# EAGLE design feuchtigkeitssensor-wasserpumpe-arduino-micro (EAGLE 7.3.0)
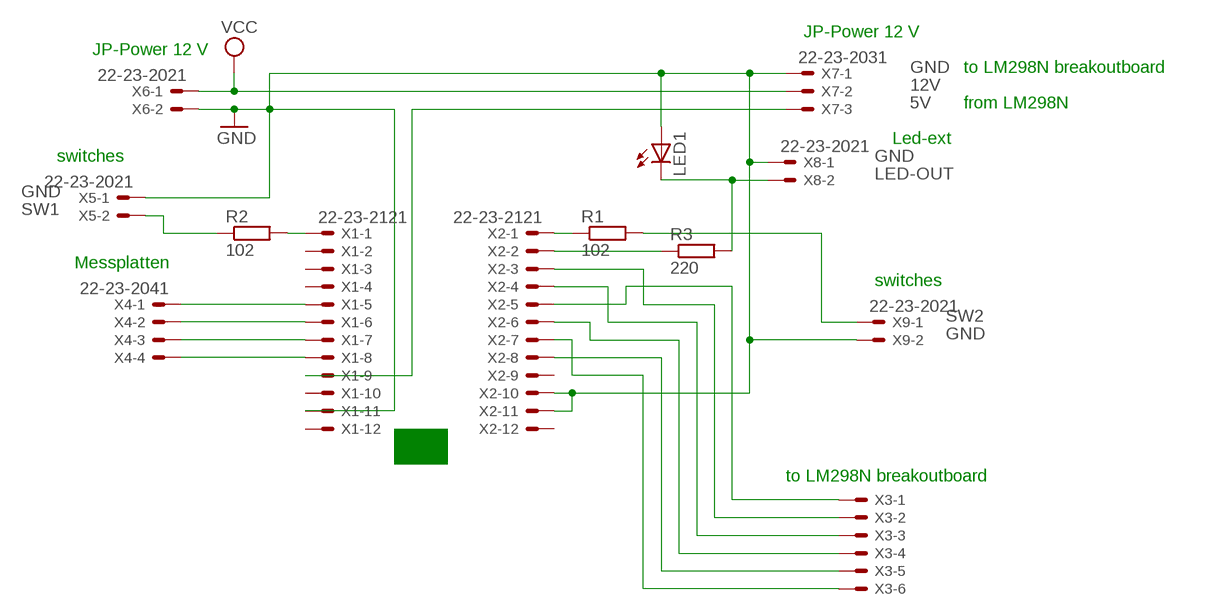
[diagram p0: schematic, sheet 1]

## Parts
LED1  LED5MM  [LED5MM]
R1  102  R-EU_M1206  [M1206]
R2  102  R-EU_M1206  [M1206]
R3  220  R-EU_M1206  [M1206]
X1  22-23-2121  [22-23-2121]
X2  22-23-2121  [22-23-2121]
X3  22-23-2061  [22-23-2061]
X4  22-23-2041  [22-23-2041]
X5  22-23-2021  [22-23-2021]
X6  22-23-2021  [22-23-2021]
X7  22-23-2031  [22-23-2031]
X8  22-23-2021  [22-23-2021]
X9  22-23-2021  [22-23-2021]

## Nets
5V [5v]: X1.9 X7.3
12V [gnd]: X6.1 X7.2 ; supply symbol labelled VCC
GND [gnd]: LED1.A X1.11 X2.10 X2.11 X5.1 X6.2 X7.1 X8.1 X9.2
LED-OUT: LED1.K(C) R3.2 X8.2
N$1: X1.8 X4.4
N$2: X1.7 X4.3
N$3: X1.6 X4.2
N$4: X1.5 X4.1
N$5: R2.2 X1.1
N$6: R1.1 X2.1
N$7: R3.1 X2.2
N$9: X2.5 X3.1
N$10: X2.3 X3.2
N$11: X2.4 X3.3
N$12: X2.7 X3.6
N$13: X2.8 X3.5
N$14: X2.6 X3.4
SW1: R2.1 X5.2
SW2: R1.2 X9.1
Unconnected: X1.2 X1.3 X1.4 X1.10 X1.12 X2.9 X2.12

## Notes on the sheet
- JP-Power 12 V
- JP-Power 12 V
- to LM298N breakoutboard
- from LM298N
- Led-ext
- switches
- Messplatten
- switches
- to LM298N breakoutboard

## Library data of the parts
LED1 = led:LED: LED OSRAM: - CHIPLED LG R971, LG N971, LY N971, LG Q971, LY Q971, LO R971, LY R971 LH N974, LH R974 LS Q976, LO Q976, LY Q976 LO Q996 - Hyper CHIPLED LW Q18S LB Q993, LB Q99A, LB R99A - SideLED LS A670, LO A670, LY A670, LG A670, LP A670 LB A673, LV A673, LT A673, LW A673 LH A674 LY A675 LS A676, LA A676, LO A676, LY A676, LW A676 LS A679, LY A679, LG A679 - Hyper Micro SIDELED® LS Y876, LA Y876, LO Y876, LY Y876 LT Y87S - SmartLED LW L88C, LW L88S LB L89C, LB L89S, LG L890 LS L89K, LO L89K, LY L89K LS L896, LA L896, LO L896, LY L896 - TOPLED LS T670, LO T670, LY T670, LG T670, LP T670 LSG T670, LSP T670, LSY T670, LOP T670, LYG T670 LG T671, LOG T671, LSG T671 LB T673, LV T673, LT T673, LW T673 LH T674 LS T676, LA T676, LO T676, LY T676, LB T676, LH T676, LSB T676, LW T676 LB T67C, LV T67C, LT T67C, LS T67K, LO T67K, LY T67K, LW E67C LS E67B, LA E67B, LO E67B, LY E67B, LB E67C, LV E67C, LT E67C LW T67C LS T679, LY T679, LG T679 LS T770, LO T770, LY T770, LG T770, LP T770 LB T773, LV T773, LT T773, LW T773 LH T774 LS E675, LA E675, LY E675, LS T675 LS T776, LA T776, LO T776, LY T776, LB T776 LHGB T686 LT T68C, LB T68C - Hyper Mini TOPLED® LB M676 - Mini TOPLED Santana® LG M470 LS M47K, LO M47K, LY M47K Source: http://www.osram.convergy.de LUXEON: - LUMILED® LXK2-PW12-R00, LXK2-PW12-S00, LXK2-PW14-U00, LXK2-PW14-V00 LXK2-PM12-R00, LXK2-PM12-S00, LXK2-PM14-U00 LXK2-PE12-Q00, LXK2-PE12-R00, LXK2-PE12-S00, LXK2-PE14-T00, LXK2-PE14-U00 LXK2-PB12-K00, LXK2-PB12-L00, LXK2-PB12-M00, LXK2-PB14-N00, LXK2-PB14-P00, LXK2-PB14-Q00 LXK2-PR12-L00, LXK2-PR12-M00, LXK2-PR14-Q00, LXK2-PR14-R00 LXK2-PD12-Q00, LXK2-PD12-R00, LXK2-PD12-S00 LXK2-PH12-R00, LXK2-PH12-S00 LXK2-PL12-P00, LXK2-PL12-Q00, LXK2-PL12-R00 Source: www.luxeon.com KINGBRIGHT: KA-3528ASYC Source: www.kingbright.com
R1-R3 = resistor:R-EU_: RESISTOR, European symbol
X1 X2 = con-molex:22-23-2121: .100" (2.54mm) Center Header - 12 Pin; MF: MOLEX; MPN: 22-23-2121; OC_FARNELL: 1462935; OC_NEWARK: 56H0456
X3 = con-molex:22-23-2061: .100" (2.54mm) Center Header - 6 Pin; MF: MOLEX; MPN: 22-23-2061; OC_FARNELL: 1462922; OC_NEWARK: 27C1933
X4 = con-molex:22-23-2041: .100" (2.54mm) Center Header - 4 Pin; MF: MOLEX; MPN: 22-23-2041; OC_FARNELL: 1462920; OC_NEWARK: 38C0355
X5 X6 X8 X9 = con-molex:22-23-2021: .100" (2.54mm) Center Header - 2 Pin; MF: MOLEX; MPN: 22-23-2021; OC_FARNELL: 1462926; OC_NEWARK: 25C3832
X7 = con-molex:22-23-2031: .100" (2.54mm) Center Header - 3 Pin; MF: MOLEX; MPN: 22-23-2031; OC_FARNELL: 1462950; OC_NEWARK: 30C0862

## Net classes
1 gnd: width 1.016 mm, drill 0.508 mm, clearance 0.508 mm
2 5v: width 0.762 mm, drill 0.508 mm, clearance 0.508 mm

## Board
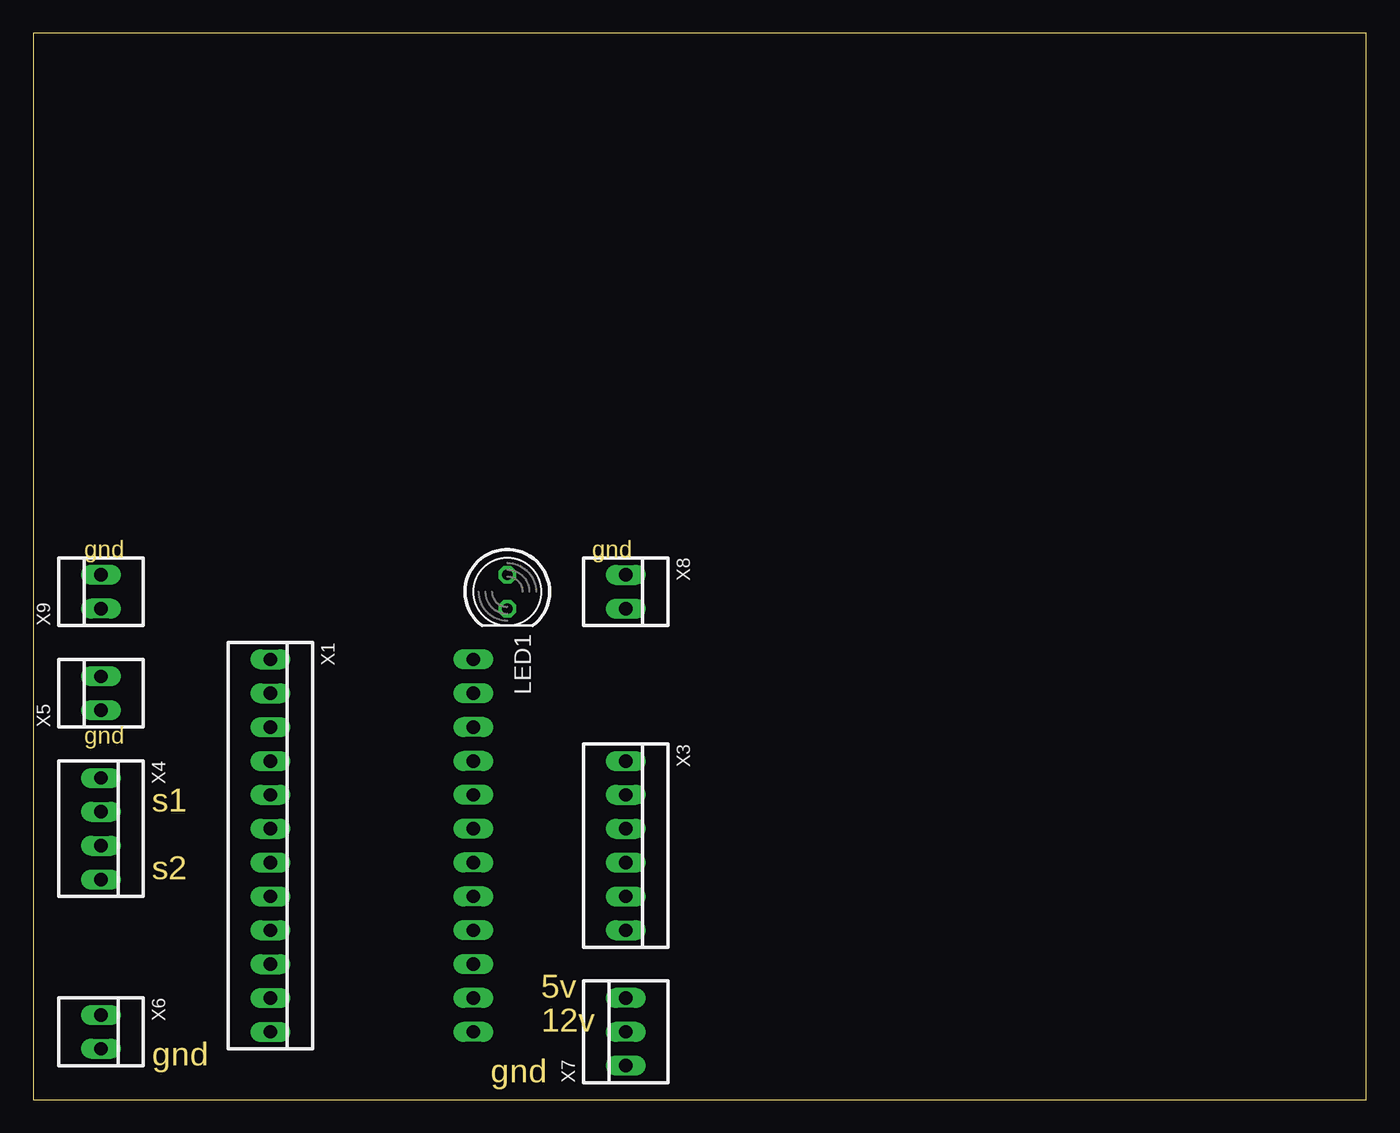
[diagram p1: board, top side]
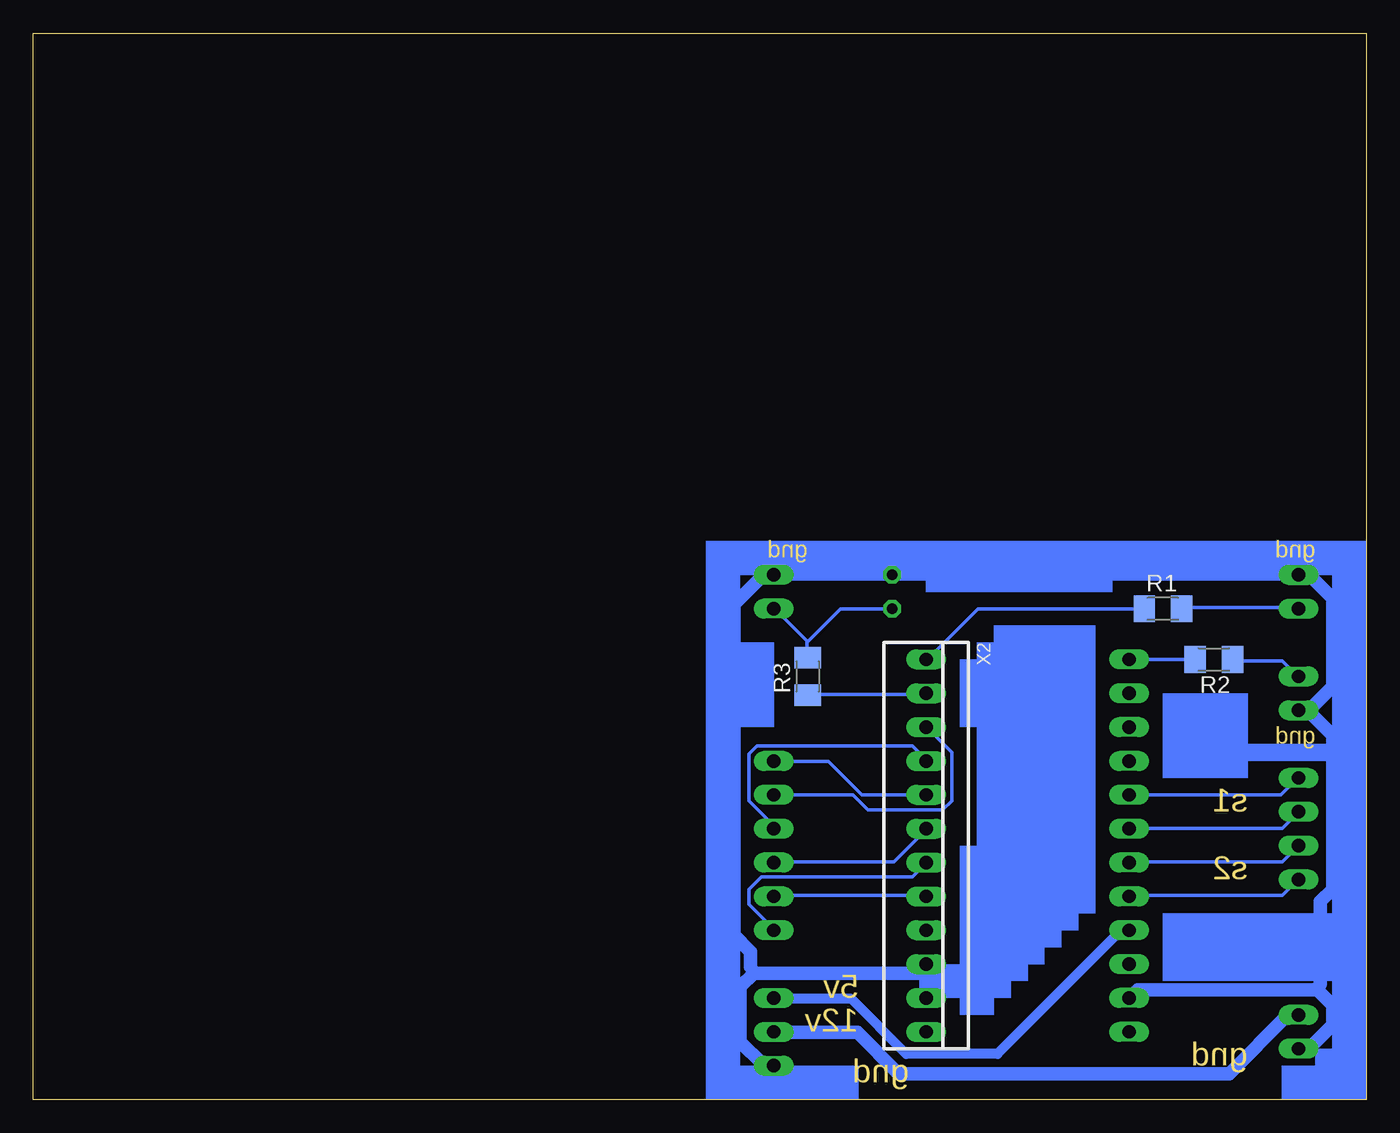
[diagram p2: board, bottom side, seen from below]

Size 100 x 80 mm. Coordinates in mm from the lower left corner, seen from the top.
Outline: 0,0 100,0 100,80 0,80 0,0
Copper layers (1*16): Top 0.035mm / dielectric 1.5mm / Bottom 0.035mm
Design rules "default": minimum track width 10mil, minimum drill 24mil, track to track 8mil, track to pad 8mil, pad to pad 8mil, via to via 8mil, smd to smd 8mil, copper to edge 40mil, drill to drill 8mil, minimum pad ring 10mil, minimum via ring 8mil, stop-mask expansion 4mil, vias tented up to drill 0mil, thermal gap 10mil

### Footprints (pad centres in the part's own frame; a part is rotated, then mirrored left to right if it is on the bottom)
LED5MM = drill 0.813 octagon: A -1.27,0; K 1.27,0
M1206 = smd 1.6 x 2: 1 -1.4,0; 2 1.4,0
22-23-2121 = drill 1 long: 1 -13.97,0; 2 -11.43,0; 3 -8.89,0; 4 -6.35,0; 5 -3.81,0; 6 -1.27,0; 7 1.27,0; 8 3.81,0; 9 6.35,0; 10 8.89,0; 11 11.43,0; 12 13.97,0
22-23-2061 = drill 1 long: 1 -6.35,0; 2 -3.81,0; 3 -1.27,0; 4 1.27,0; 5 3.81,0; 6 6.35,0
22-23-2041 = drill 1 long: 1 -3.81,0; 2 -1.27,0; 3 1.27,0; 4 3.81,0
22-23-2021 = drill 1 long: 1 -1.27,0; 2 1.27,0
22-23-2031 = drill 1 long: 1 -2.54,0; 2 0,0; 3 2.54,0

### Placement (x,y rotation side)
LED1  35.56,38.1 270 top
R1  15.24,36.83 0 bottom
R2  11.43,33.02 180 bottom
R3  41.91,31.75 90 bottom
X1  17.78,19.05 270 top
X2  33.02,19.05 270 bottom
X3  44.45,19.05 270 top
X4  5.08,20.32 270 top
X5  5.08,30.48 90 top
X6  5.08,5.08 270 top
X7  44.45,5.08 90 top
X8  44.45,38.1 270 top
X9  5.08,38.1 90 top

### Tracks (layer width: path | path; a pad name or v marks a point on that pad's centre or on a via)
5V
  Bottom 0.762: X7.3 44.35,7.54 38.63,7.54 34.52,3.43 27.66,3.43 18.4,12.69 17.83,12.69 X1.9
12V
  Bottom 1.016: X7.2 44.35,5.03 38.18,5.03 35.09,1.94 10.29,1.94 5.94,6.29 5.14,6.29 X6.1
GND
  Bottom 1.016: X2.11 33.03,7.66 33.03,10.06 X2.10 33.49,9.49 45.95,9.49 | 45.95,9.49 46.98,8.46 46.98,4.34 45.26,2.63 44.46,2.63 X7.1 | 3.66,8.23 2.52,7.09 2.52,5.6 4.23,3.89 5.03,3.89 X6.2 | 3.66,8.23 17.14,8.23 17.72,7.66 X1.11 | 3.66,8.23 3.43,8.69 3.43,14.86 2.52,15.77 2.52,27.32 4,28.8 X5.1 5.03,29.26 4.23,29.26 2.52,30.98 2.52,37.6 4.23,39.32 5.03,39.32 X9.2 5.49,39.43 35.09,39.43 LED1.A 35.66,39.43 44.35,39.43 X8.1 44.92,39.2 45.38,39.2 47.43,37.15 47.43,12.34 46.18,11.09 46.18,9.94 45.95,9.49
LED-OUT
  Bottom 0.254: 41.95,34.4 41.95,33.26 R3.2 | 41.95,34.4 44.35,36.8 X8.2 | LED1.K 35.66,36.8 39.43,36.8 41.83,34.4 41.95,34.4
N$1
  Bottom 0.254: X1.8 17.72,15.32 6.29,15.32 5.14,16.46 X4.4
N$2
  Bottom 0.254: X1.7 17.72,17.83 6.29,17.83 5.14,18.97 X4.3
N$3
  Bottom 0.254: X1.6 17.72,20.34 6.29,20.34 5.14,21.49 X4.2
N$4
  Bottom 0.254: X1.5 6.4,22.86 5.14,24.12 X4.1
N$5
  Bottom 0.254: R2.2 12.92,33.03 17.72,33.03 X1.1
N$6
  Bottom 0.254: R1.1 16.69,36.8 29.15,36.8 32.92,33.03 X2.1
N$7
  Bottom 0.254: R3.1 41.83,30.4 33.03,30.4 X2.2
N$9
  Bottom 0.254: X2.5 37.83,22.86 40.35,25.38 44.35,25.38 X3.1
N$10
  Bottom 0.254: X3.2 38.52,22.86 37.38,21.72 31.77,21.72 31.09,22.4 31.09,26.06 32.92,27.89 X2.3
N$11
  Bottom 0.254: X3.3 44.46,20.34 44.46,20.57 46.29,22.4 46.29,25.95 45.72,26.52 34.06,26.52 33.03,25.49 X2.4
N$12
  Bottom 0.254: X3.6 44.46,12.8 46.29,14.63 46.29,15.77 45.38,16.69 34.06,16.69 33.03,17.72 X2.7
N$13
  Bottom 0.254: X2.8 33.03,15.32 44.35,15.32 X3.5
N$14
  Bottom 0.254: X3.4 44.35,17.83 35.43,17.83 33.03,20.23 X2.6
SW1
  Bottom 0.254: R2.1 9.94,32.92 6.29,32.92 5.14,31.77 X5.2
SW2
  Bottom 0.254: R1.2 13.83,36.92 5.14,36.92 X9.1
(copper drawn outside any net)
  shapes: Bottom area x22

### Text on the board
Dimension: gnd | gnd | gnd | s1 | s2 | 5v | 12v | gnd | gnd